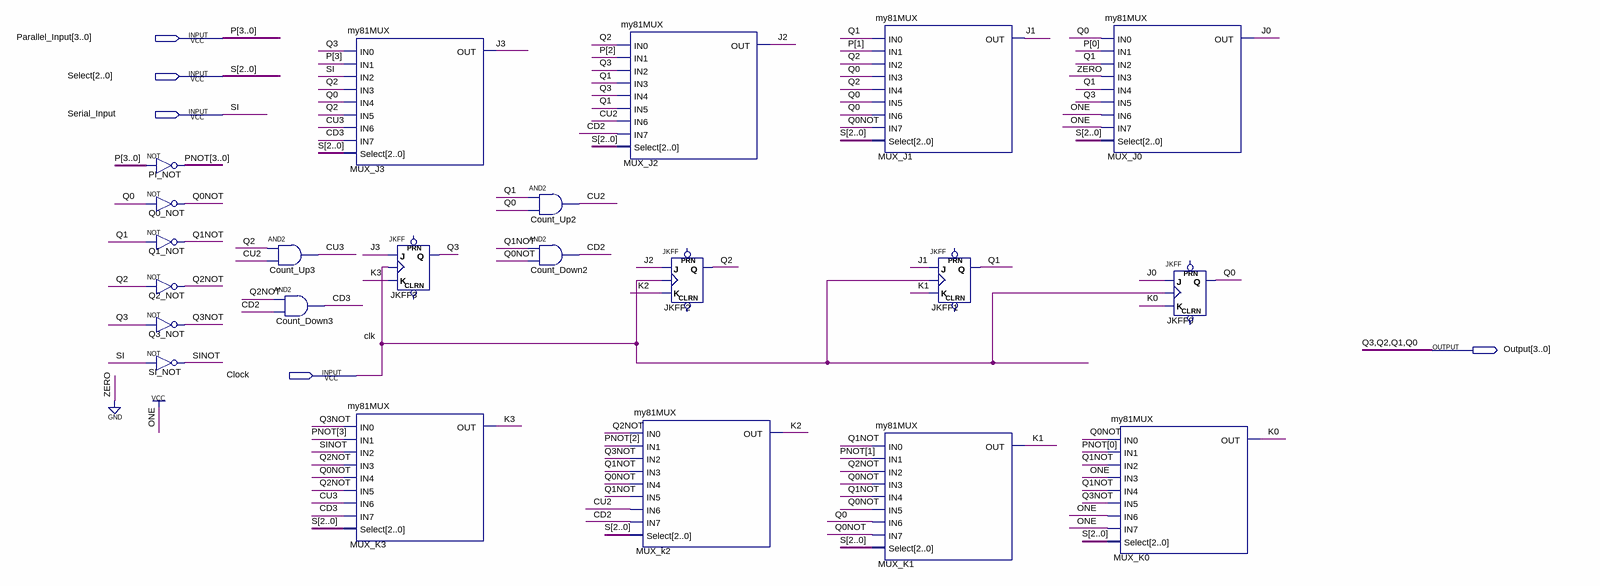
[diagram p0: schematic sheet]
// Quartus schematic Universal_Shift_Register.bdf as structural Verilog: 22 symbols, 5 pins
module Universal_Shift_Register (
  input  [3:0] Parallel_Input,
  input  [2:0] Select,
  input  Serial_Input,
  input  Clock,
  output [3:0] Output
);

  wire CD2, CD3, CU2, CU3, J0, J1, J2, J3, K0, K1, K2, K3, Q0NOT, Q1NOT, Q2NOT, Q3NOT, SINOT;
  wire [3:0] PNOT;

  assign PNOT = ~Parallel_Input;  // NOT PI_NOT, 4 bits wide
  not Q0_NOT (Q0NOT, Output[0]);
  not Q1_NOT (Q1NOT, Output[1]);
  not Q2_NOT (Q2NOT, Output[2]);
  not Q3_NOT (Q3NOT, Output[3]);
  not SI_NOT (SINOT, Serial_Input);
  and Count_Up3 (CU3, Output[2], CU2);
  and Count_Down3 (CD3, Q2NOT, CD2);
  my81MUX MUX_J3 (
    .IN0(Output[3]), .IN1(Parallel_Input[3]), .IN2(Serial_Input), .IN3(Output[2]), .IN4(Output[0]),
    .IN5(Output[2]), .IN6(CU3), .IN7(CD3), .Select(Select), .OUT(J3));
  JKFF JKFF3 (.K(K3), .J(J3), .CLK(Clock), .Q(Output[3]));  // open: PRN, CLRN
  my81MUX MUX_K3 (
    .IN0(Q3NOT), .IN1(PNOT[3]), .IN2(SINOT), .IN3(Q2NOT), .IN4(Q0NOT), .IN5(Q2NOT), .IN6(CU3), .IN7(CD3),
    .Select(Select), .OUT(K3));
  and Count_Up2 (CU2, Output[1], Output[0]);
  and Count_Down2 (CD2, Q1NOT, Q0NOT);
  my81MUX MUX_J2 (
    .IN0(Output[2]), .IN1(Parallel_Input[2]), .IN2(Output[3]), .IN3(Output[1]), .IN4(Output[3]),
    .IN5(Output[1]), .IN6(CU2), .IN7(CD2), .Select(Select), .OUT(J2));
  my81MUX MUX_k2 (
    .IN0(Q2NOT), .IN1(PNOT[2]), .IN2(Q3NOT), .IN3(Q1NOT), .IN4(Q0NOT), .IN5(Q1NOT), .IN6(CU2), .IN7(CD2),
    .Select(Select), .OUT(K2));
  JKFF JKFF2 (.K(K2), .J(J2), .CLK(Clock), .Q(Output[2]));  // open: PRN, CLRN
  my81MUX MUX_J1 (
    .IN0(Output[1]), .IN1(Parallel_Input[1]), .IN2(Output[2]), .IN3(Output[0]), .IN4(Output[2]),
    .IN5(Output[0]), .IN6(Output[0]), .IN7(Q0NOT), .Select(Select), .OUT(J1));
  my81MUX MUX_K1 (
    .IN0(Q1NOT), .IN1(PNOT[1]), .IN2(Q2NOT), .IN3(Q0NOT), .IN4(Q1NOT), .IN5(Q0NOT), .IN6(Output[0]),
    .IN7(Q0NOT), .Select(Select), .OUT(K1));
  JKFF JKFF1 (.K(K1), .J(J1), .CLK(Clock), .Q(Output[1]));  // open: PRN, CLRN
  my81MUX MUX_J0 (
    .IN0(Output[0]), .IN1(Parallel_Input[0]), .IN2(Output[1]), .IN3(1'b0), .IN4(Output[1]), .IN5(Output[3]),
    .IN6(1'b1), .IN7(1'b1), .Select(Select), .OUT(J0));
  my81MUX MUX_K0 (
    .IN0(Q0NOT), .IN1(PNOT[0]), .IN2(Q1NOT), .IN3(1'b1), .IN4(Q1NOT), .IN5(Q3NOT), .IN6(1'b1), .IN7(1'b1),
    .Select(Select), .OUT(K0));
  JKFF JKFF0 (.K(K0), .J(J0), .CLK(Clock), .Q(Output[0]));  // open: PRN, CLRN

  // Other names for the same wires on the sheet: clk = Clock; P[3:0] = Parallel_Input; Q0 = Output[0]; Q1 = Output[1];
  //   Q2 = Output[2]; Q3 = Output[3]; S[2:0] = Select; SI = Serial_Input
endmodule
